# Altium schematic sheet battery_management.SchDoc
size A4
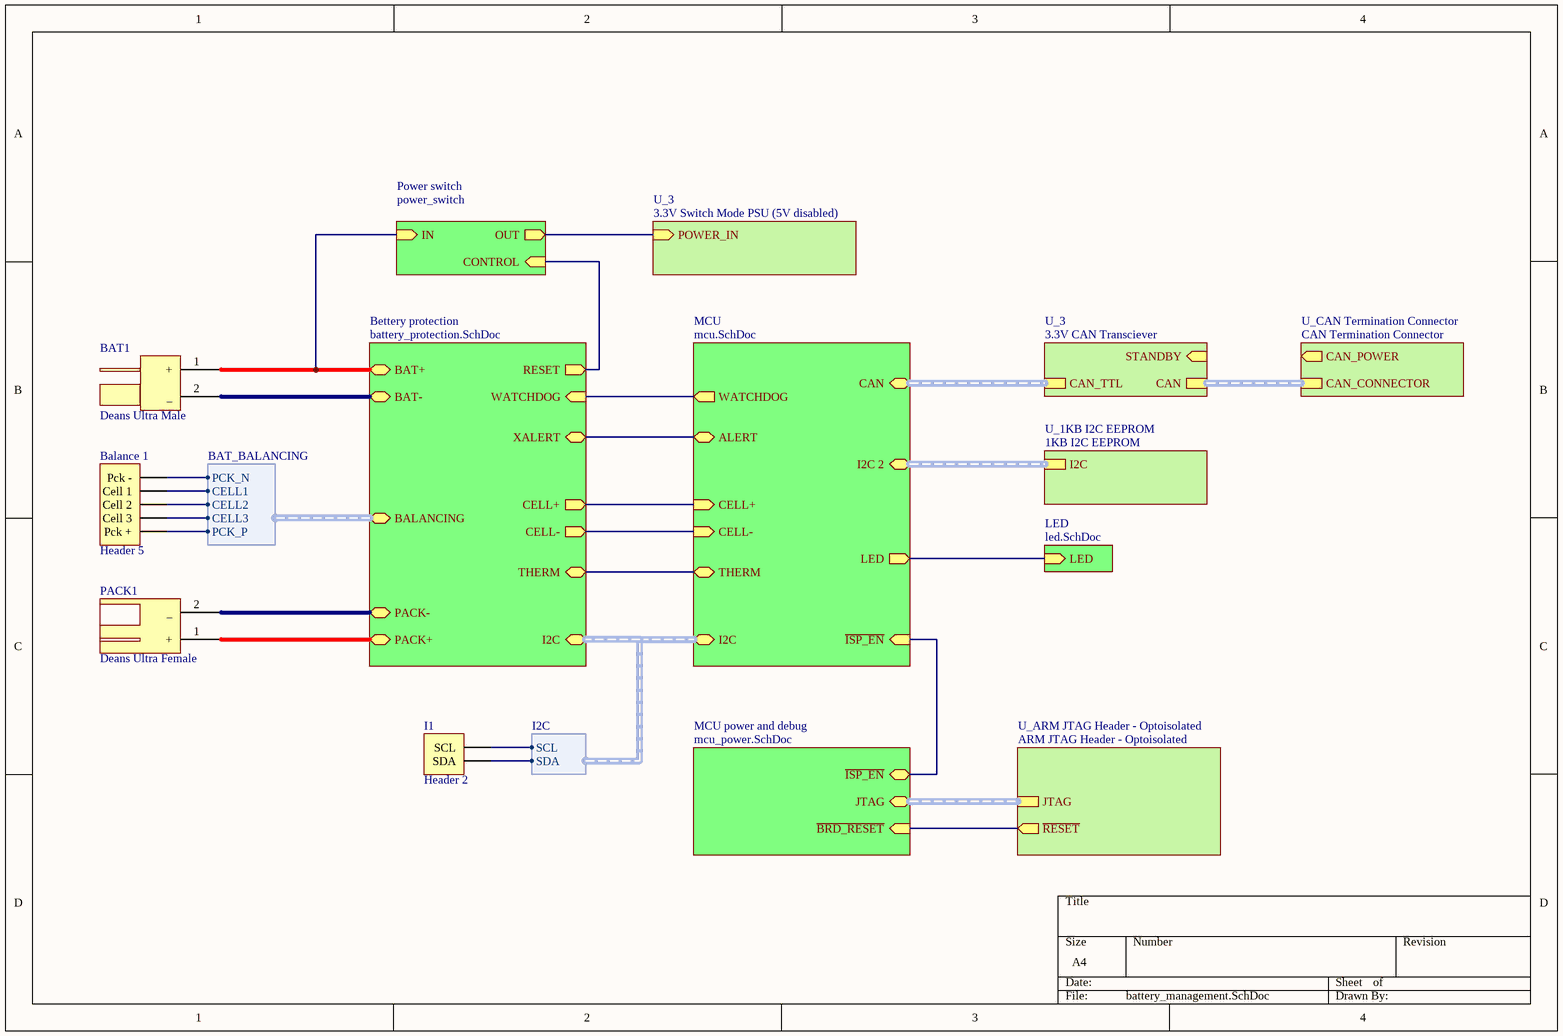
[diagram p0: battery_management.SchDoc]

## Parts
Balance_1  Header 5  [HDR1X5]
BAT1  Deans Ultra Male  [DEANS_MALE_SIDEWAYS - n]
I1  Header 2  [HDR1X2]
PACK1  Deans Ultra Female  [DEANS_FEMALE_SIDEWAYS - n]

## Sub-sheets
Bettery protection = battery_protection.SchDoc: BAT+, BAT-, BALANCING (harness BAT_BALANCING), PACK-, PACK+, CELL+ (out), CELL- (out), THERM, WATCHDOG (in), RESET (out), I2C (harness I2C), XALERT
LED = led.SchDoc: LED (in)
MCU = mcu.SchDoc: CELL+ (in), CELL- (in), THERM, WATCHDOG (out), LED (out), I2C (harness I2C), CAN (harness CAN_TTL), I2C 2 (harness I2C), ~{ISP_EN} (in), ALERT
MCU power and debug = mcu_power.SchDoc: ~{BRD_RESET} (in), JTAG (harness ARM_JTAG), ~{ISP_EN}
Power switch = power_switch: IN (in), OUT (out), CONTROL (in)
U_1KB I2C EEPROM = 1KB I2C EEPROM: I2C (harness I2C)
U_3 = 3.3V CAN Transciever: CAN_TTL (harness CAN_TTL), CAN (harness CAN), STANDBY (in)
U_3 = 3.3V Switch Mode PSU (5V disabled): POWER_IN (in)
U_ARM JTAG Header - Optoisolated = ARM JTAG Header - Optoisolated: JTAG (harness ARM_JTAG), ~{RESET} (out)
U_CAN Termination Connector = CAN Termination Connector: CAN_CONNECTOR (harness CAN), CAN_POWER (out)

## Harnesses
BAT_BALANCING: PCK_N, CELL1, CELL2, CELL3, PCK_P
I2C: SCL, SDA

## Nets
NetBalance_1_1: Balance_1.1(Pck_+) ; sheet Bettery protection/BALANCING.PCK_P
NetBalance_1_2: Balance_1.2(Cell_3) ; sheet Bettery protection/BALANCING.CELL3
NetBalance_1_3: Balance_1.3(Cell_2) ; sheet Bettery protection/BALANCING.CELL2
NetBalance_1_4: Balance_1.4(Cell_1) ; sheet Bettery protection/BALANCING.CELL1
NetBalance_1_5: Balance_1.5(Pck_-) ; sheet Bettery protection/BALANCING.PCK_N
NetBAT1_1: BAT1.1(+) ; sheet Bettery protection/BAT+, sheet Power switch/IN
NetBAT1_2: BAT1.2(_) ; sheet Bettery protection/BAT-
NetI1_1: I1.1(SDA) ; sheet Bettery protection/I2C.SDA
NetI1_2: I1.2(SCL) ; sheet Bettery protection/I2C.SCL
NetPACK1_1: PACK1.1(+) ; sheet Bettery protection/PACK+
NetPACK1_2: PACK1.2(_) ; sheet Bettery protection/PACK-
(unnamed): sheet Bettery protection/CELL+, sheet MCU/CELL+
(unnamed): sheet Bettery protection/CELL-, sheet MCU/CELL-
(unnamed): sheet Bettery protection/THERM, sheet MCU/THERM
(unnamed): sheet Bettery protection/WATCHDOG, sheet MCU/WATCHDOG
(unnamed): sheet Bettery protection/RESET, sheet Power switch/CONTROL
(unnamed): sheet Bettery protection/XALERT, sheet MCU/ALERT
(unnamed): sheet MCU/LED, sheet LED/LED
(unnamed): sheet MCU/~{ISP_EN}, sheet MCU power and debug/~{ISP_EN}
(unnamed): sheet MCU power and debug/~{BRD_RESET}, sheet U_ARM JTAG Header - Optoisolated/~{RESET}
(unnamed): sheet Power switch/OUT, sheet U_3/POWER_IN

## Buses and harness runs
harness sheet Bettery protection/I2C = sheet MCU/I2C
harness sheet MCU power and debug/JTAG = sheet U_ARM JTAG Header - Optoisolated/JTAG
harness sheet MCU/CAN = sheet U_3/CAN_TTL
harness sheet MCU/I2C 2 = sheet U_1KB I2C EEPROM/I2C
harness sheet U_3/CAN = sheet U_CAN Termination Connector/CAN_CONNECTOR

## Library data of the parts
Balance_1 = Header 5: Header, 5-Pin; LatestRevisionDate: 17-Jul-2002; LatestRevisionNote: Re-released for DXP Platform.; Publisher: Altium Limited
BAT1 = DeansUltraMale
I1 = Header 2: Header, 2-Pin; LatestRevisionDate: 17-Jul-2002; LatestRevisionNote: Re-released for DXP Platform.; Publisher: Altium Limited
PACK1 = DeansUltraFemale